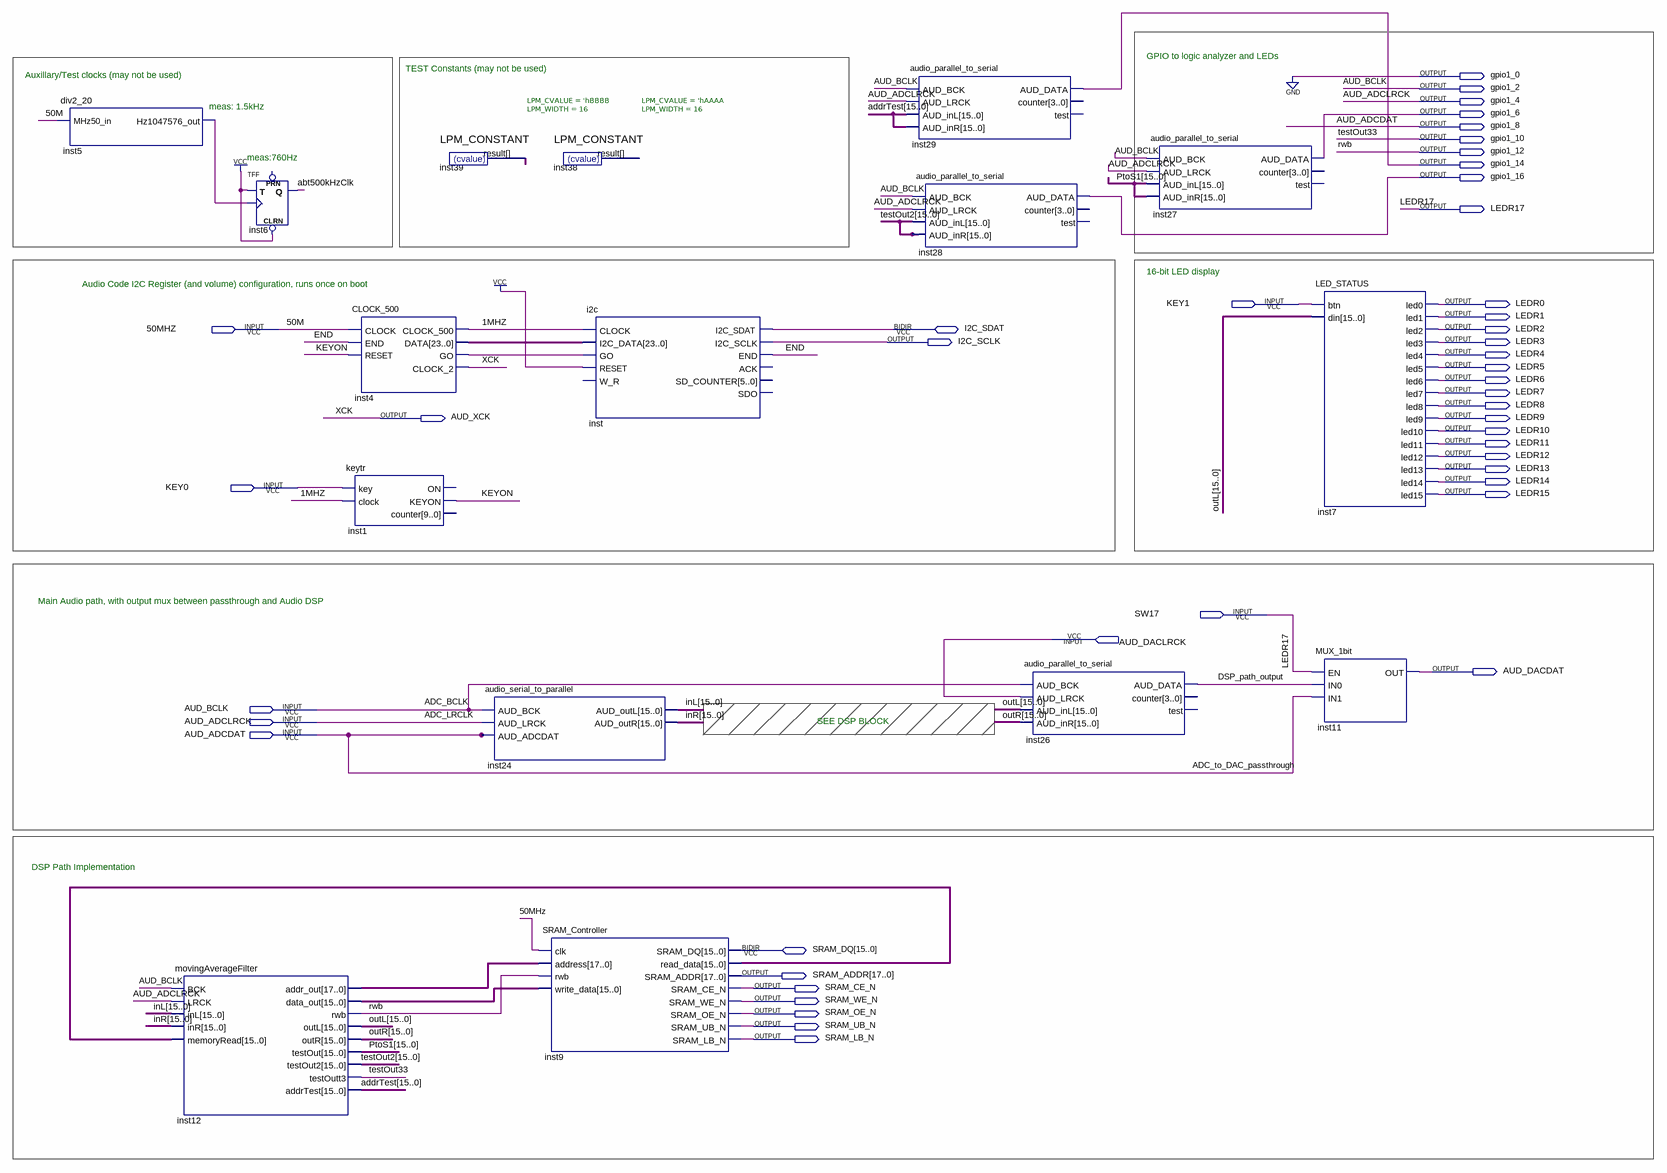
[diagram p0: schematic sheet]
// Quartus schematic DE2_i2sound.bdf as structural Verilog: 16 symbols, 45 pins
module DE2_i2sound (
  input  KEY1,
  input  \50MHZ ,
  input  KEY0,
  input  SW17,
  input  AUD_DACLRCK,
  input  AUD_BCLK,
  input  AUD_ADCLRCK,
  input  AUD_ADCDAT,
  inout  I2C_SDAT,
  inout  [15:0] SRAM_DQ,
  output gpio1_0,
  output gpio1_2,
  output gpio1_4,
  output gpio1_6,
  output gpio1_8,
  output gpio1_10,
  output gpio1_12,
  output gpio1_14,
  output gpio1_16,
  output LEDR17,
  output LEDR0,
  output LEDR1,
  output LEDR2,
  output I2C_SCLK,
  output LEDR3,
  output LEDR4,
  output LEDR5,
  output LEDR6,
  output LEDR7,
  output LEDR8,
  output AUD_XCK,
  output LEDR9,
  output LEDR10,
  output LEDR11,
  output LEDR12,
  output LEDR13,
  output LEDR14,
  output LEDR15,
  output AUD_DACDAT,
  output [17:0] SRAM_ADDR,
  output SRAM_CE_N,
  output SRAM_WE_N,
  output SRAM_OE_N,
  output SRAM_UB_N,
  output SRAM_LB_N
);

  wire \1MHZ , abt500kHzClk, DSP_path_output, END, inst4_go, inst5_hz1047576_out, KEYON;
  wire [15:0] addrTest, inL, inR, inst9_read_data, inst12_data_out, inst39_result, outL, outR, PtoS1,
       testOut2;
  wire [17:0] inst12_addr_out;
  wire [23:0] inst4_data;

  div2_20 inst5 (.MHz50_in(\50MHZ ), .Hz1047576_out(inst5_hz1047576_out));
  movingAverageFilter inst12 (
    .BCK(AUD_BCLK), .LRCK(AUD_ADCLRCK), .inL(inL), .inR(inR), .memoryRead(inst9_read_data),
    .addr_out(inst12_addr_out), .data_out(inst12_data_out), .rwb(gpio1_12), .outL(outL), .outR(outR),
    .testOut(PtoS1), .testOut2(testOut2), .testOutt3(gpio1_10), .addrTest(addrTest));
  TFF inst6 (.CLRN(1'b1), .T(1'b1), .CLK(inst5_hz1047576_out), .Q(abt500kHzClk));  // open: PRN
  CLOCK_500 inst4 (
    .CLOCK(\50MHZ ), .END(END), .RESET(KEYON), .CLOCK_500(\1MHZ ), .DATA(inst4_data), .GO(inst4_go),
    .CLOCK_2(AUD_XCK));
  keytr inst1 (.key(KEY0), .clock(\1MHZ ), .KEYON(KEYON));  // open: ON, counter
  LPM_CONSTANT #(.LPM_CVALUE('hBBBB), .LPM_WIDTH(16)) inst39 (.result(inst39_result));
  audio_serial_to_parallel inst24 (
    .AUD_BCK(AUD_BCLK), .AUD_LRCK(AUD_ADCLRCK), .AUD_ADCDAT(AUD_ADCDAT), .AUD_outL(inL), .AUD_outR(inR));
  LPM_CONSTANT #(.LPM_CVALUE('hAAAA), .LPM_WIDTH(16)) inst38 ();  // open: result
  SRAM_Controller inst9 (
    .clk(\50MHZ ), .address(inst12_addr_out), .rwb(gpio1_12), .write_data(inst12_data_out),
    .read_data(inst9_read_data), .SRAM_ADDR(SRAM_ADDR), .SRAM_CE_N(SRAM_CE_N), .SRAM_WE_N(SRAM_WE_N),
    .SRAM_OE_N(SRAM_OE_N), .SRAM_UB_N(SRAM_UB_N), .SRAM_LB_N(SRAM_LB_N), .SRAM_DQ(SRAM_DQ));
  i2c inst (
    .CLOCK(\1MHZ ), .I2C_DATA(inst4_data), .GO(inst4_go), .RESET(1'b1), .I2C_SCLK(I2C_SCLK), .END(END),
    .I2C_SDAT(I2C_SDAT));  // open: W_R, ACK, SD_COUNTER, SDO
  audio_parallel_to_serial inst29 (
    .AUD_BCK(AUD_BCLK), .AUD_LRCK(AUD_ADCLRCK), .AUD_inL(addrTest), .AUD_inR(addrTest), .AUD_DATA(gpio1_14));  // open: counter, test
  audio_parallel_to_serial inst28 (
    .AUD_BCK(AUD_BCLK), .AUD_LRCK(AUD_ADCLRCK), .AUD_inL(testOut2), .AUD_inR(testOut2), .AUD_DATA(gpio1_16));  // open: counter, test
  audio_parallel_to_serial inst26 (
    .AUD_BCK(AUD_BCLK), .AUD_LRCK(AUD_DACLRCK), .AUD_inL(outL), .AUD_inR(outR), .AUD_DATA(DSP_path_output));  // open: counter, test
  audio_parallel_to_serial inst27 (
    .AUD_BCK(AUD_BCLK), .AUD_LRCK(AUD_ADCLRCK), .AUD_inL(PtoS1), .AUD_inR(PtoS1), .AUD_DATA(gpio1_6));  // open: counter, test
  LED_STATUS inst7 (
    .btn(KEY1), .din(outL), .led0(LEDR0), .led1(LEDR1), .led2(LEDR2), .led3(LEDR3), .led4(LEDR4),
    .led5(LEDR5), .led6(LEDR6), .led7(LEDR7), .led8(LEDR8), .led9(LEDR9), .led10(LEDR10), .led11(LEDR11),
    .led12(LEDR12), .led13(LEDR13), .led14(LEDR14), .led15(LEDR15));
  MUX_1bit inst11 (.EN(SW17), .IN0(DSP_path_output), .IN1(AUD_ADCDAT), .OUT(AUD_DACDAT));

  assign gpio1_0 = 1'b0;
  assign gpio1_2 = AUD_BCLK;
  assign gpio1_4 = AUD_ADCLRCK;
  assign gpio1_8 = AUD_ADCDAT;
  assign LEDR17 = SW17;

  // Other names for the same wires on the sheet: 50M = \50MHZ ; ADC_BCLK = AUD_BCLK; ADC_LRCLK = AUD_ADCLRCK;
  //   ADC_to_DAC_passthrough = AUD_ADCDAT; rwb = gpio1_12; testOut33 = gpio1_10; XCK = AUD_XCK

  // Notes on the sheet:
  //   GPIO to logic analyzer and LEDs
  //   TEST Constants (may not be used)
  //   Auxillary/Test clocks (may not be used)
  //   meas: 1.5kHz
  //   meas:760Hz
  //   16-bit LED display
  //   Audio Code I2C Register (and volume) configuration, runs once on boot
  //   Main Audio path, with output mux between passthrough and Audio DSP
  //   SEE DSP BLOCK
  //   DSP Path Implementation
endmodule
